# EasyEDA Pro project K1-Core-Val-R0-G2.2-from-hub-v2.epro, schematic Schematic1
Board Name: Board1; Create Date: 2026-08-28; Page Name: P1; Project Name: K1-Core-Val-R0; Schematic Name: Schematic1; Update Date: 2026-08-28; Company: SPECTRASYNQ; Page Size: Custom; Version: V1.0
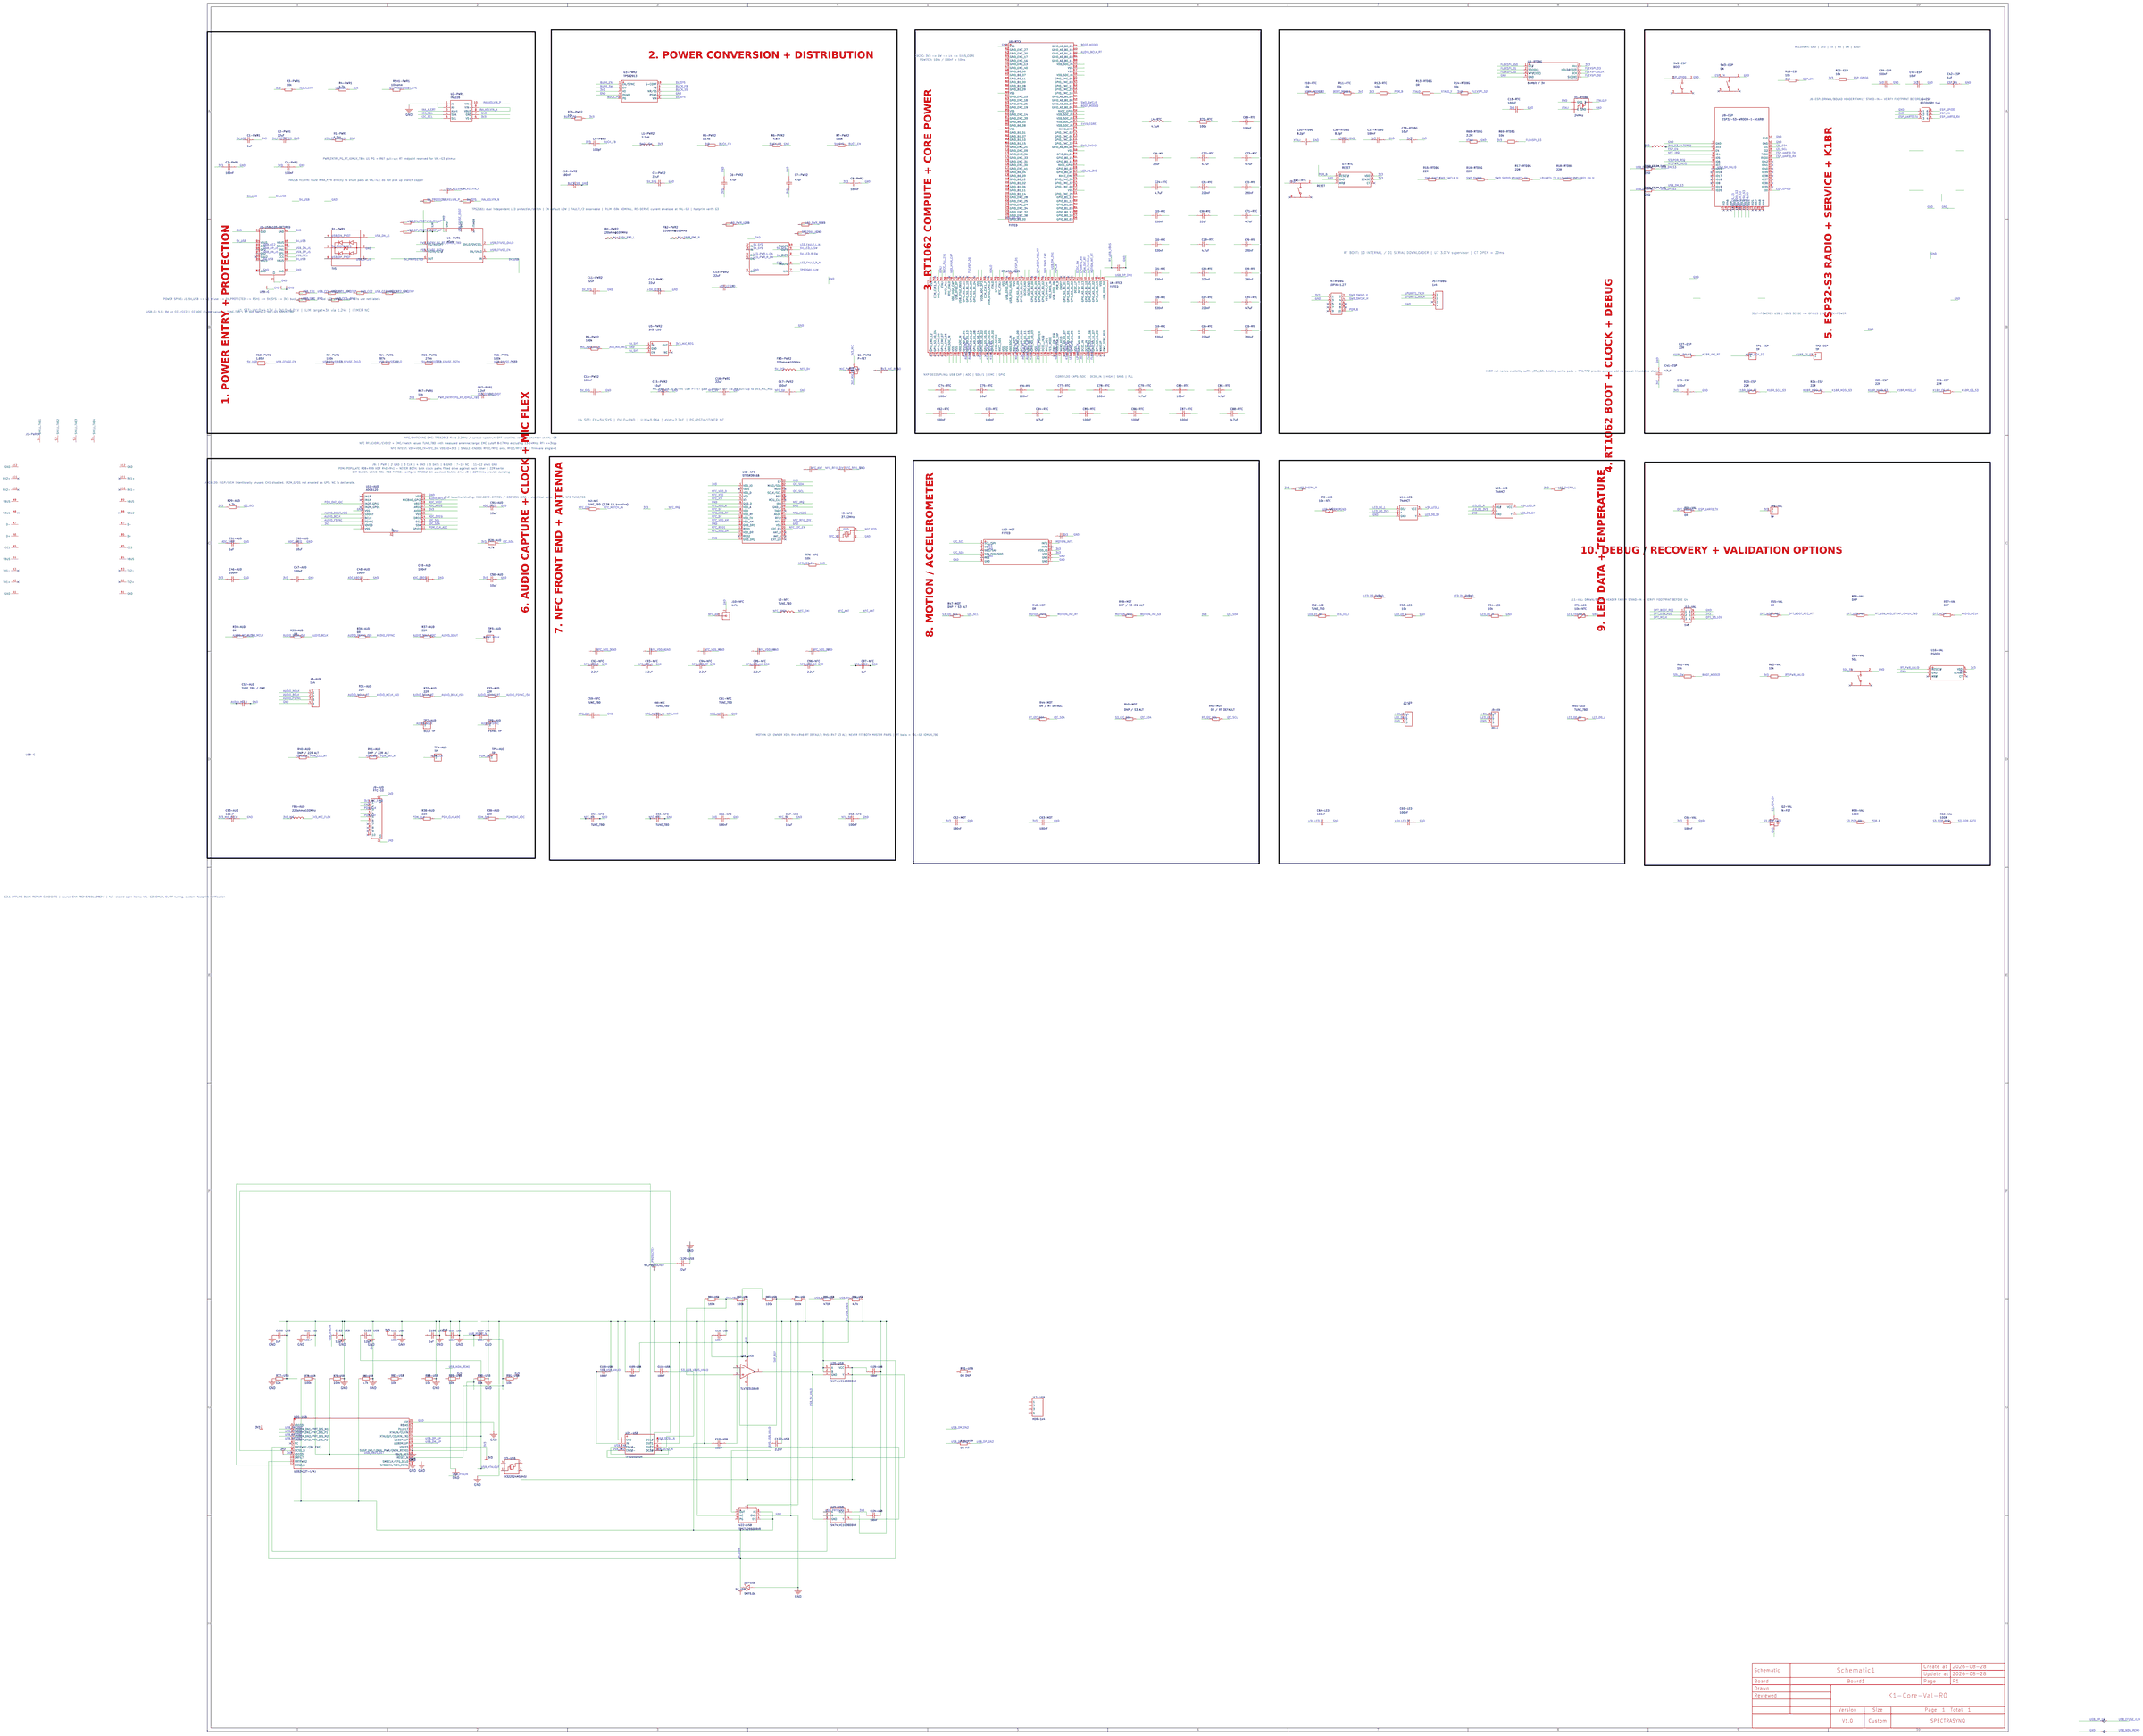
[diagram p0: schematic sheet]

## Parts
C1-PWR1  22uF  [C0805]
C2-PWR1  22uF  [C0805]
C3-PWR1  100nF  [C0402]
C4-PWR1  100nF  [C0402]
C5-PWR2  22uF  [C0805]
C6-PWR2  47uF  [C0805]
C7-PWR2  47uF  [C0805]
C8-PWR2  100nF  [C0402]
C9-PWR2  100pF  [C0402]
C10-PWR2  100nF  [C0402]
C11-PWR2  22uF  [C0805]
C12-PWR2  22uF  [C0805]
C13-PWR2  22uF  [C0805]
C14-PWR2  100nF  [C0402]
C15-PWR2  10uF  [C0402]
C16-PWR2  22uF  [C0805]
C17-PWR2  100nF  [C0402]
C18-RTC  100nF  [C0402]
C19-RTC  220nF  [C0402]
C20-RTC  220nF  [C0402]
C21-RTC  220nF  [C0402]
C22-RTC  220nF  [C0402]
C23-RTC  220nF  [C0402]
C24-RTC  4.7uF  [C0402]
C25-RTC  22uF  [C0603]
C26-RTC  220nF  [C0402]
C27-RTC  220nF  [C0402]
C28-RTC  220nF  [C0402]
C29-RTC  4.7uF  [C0402]
C30-RTC  22uF  [C0603]
C31-RTC  220nF  [C0402]
C32-RTC  4.7uF  [C0402]
C33-RTC  220nF  [C0402]
C34-RTC  4.7uF  [C0402]
C35-RTDBG  8.2pF  [C0402]
C36-RTDBG  8.2pF  [C0402]
C37-RTDBG  100nF  [C0402]
C38-RTDBG  10uF  [C0402]
C39-ESP  100nF  [C0402]
C40-ESP  10uF  [C0402]
C41-ESP  47uF  [C0805]
C42-ESP  1uF  [C0402]
C45-ESP  100nF  [C0402]
C46-AUD  100nF  [C0402]
C47-AUD  100nF  [C0402]
C48-AUD  100nF  [C0402]
C49-AUD  100nF  [C0402]
C50-AUD  10uF  [C0402]
C51-AUD  1uF  [C0402]
C52-AUD  TUNE_TBD  [C0402]  (no BOM)
C53-AUD  100nF  [C0402]
C54-NFC  TUNE_TBD  [C0402]  (no BOM)
C55-NFC  TUNE_TBD  [C0402]  (no BOM)
C56-NFC  100nF  [C0402]
C57-NFC  10uF  [C0402]
C58-NFC  100nF  [C0402]
C59-NFC  TUNE_TBD  [C0402]
C60-NFC  TUNE_TBD  [C0402]
C61-NFC  TUNE_TBD  [C0402]
C62-MOT  100nF  [C0402]
C63-MOT  100nF  [C0402]
C64-LED  100nF  [C0402]
C65-LED  100nF  [C0402]
C66-VAL  100nF  [C0402]
C67-PWR1  2.2nF  [C0402]
C69-RTC  220nF  [C0402]
C70-RTC  220nF  [C0402]
C71-RTC  4.7uF  [C0402]
C72-RTC  220nF  [C0402]
C73-RTC  4.7uF  [C0402]
C74-RTC  100nF  [C0402]
C75-RTC  10uF  [C0402]
C76-RTC  220nF  [C0402]
C77-RTC  1uF  [C0402]
C78-RTC  100nF  [C0402]
C79-RTC  4.7uF  [C0402]
C80-RTC  100nF  [C0402]
C81-RTC  4.7uF  [C0402]
C82-RTC  100nF  [C0402]
C83-RTC  100nF  [C0402]
C84-RTC  4.7uF  [C0402]
C85-RTC  100nF  [C0402]
C86-RTC  100nF  [C0402]
C87-RTC  100nF  [C0402]
C88-RTC  4.7uF  [C0402]
C89-RTC  100nF  [C0402]
C90-AUD  10uF  [C0402]
C91-AUD  10uF  [C0402]
C92-NFC  2.2uF  [C0402]
C93-NFC  2.2uF  [C0402]
C94-NFC  2.2uF  [C0402]
C95-NFC  2.2uF  [C0402]
C96-NFC  2.2uF  [C0402]
C97-NFC  1uF  [C0402]
C98-NFC  10nF  [C0402]  (no BOM)
C99-NFC  10nF  [C0402]  (no BOM)
C100-USB  1uF  [C0603]
C101-USB  100nF  [C0603]
C102-USB  12pF  [C0402]
C103-USB  12pF  [C0402]
C104-USB  100nF  [C0603]
C105-USB  1uF  [C0603]
C106-USB  100nF  [C0603]
C107-USB  100nF  [C0603]
C108-USB  100nF  [C0603]
C109-USB  100nF  [C0603]
C110-USB  100nF  [C0603]
C120-USB  22uF  [C0805]
C121-USB  100nF  [C0603]
C122-USB  2.2uF  [C0603]
C123-USB  100nF  [C0603]
C124-USB  100nF  [C0603]
C125-USB  100nF  [C0603]
C910-NFC  10nF  [C0402]  (no BOM)
C911-NFC  10nF  [C0402]  (no BOM)
C912-NFC  10nF  [C0402]  (no BOM)
CINA_DIFF-PWR1  100nF  [C0402]
CMICREG-PWR2  1uF  [C0402]
CMOT-BULK  10uF  [C0402]
CUSBVBUS-RTC  1uF  [C0402]
CVDR1-NFC  TUNE_TBD  [C0402]  (no BOM)
CVDR2-NFC  TUNE_TBD  [C0402]  (no BOM)
D1-PWR1  TVS  [SOT-23-6_L2.9-W1.6-P0.95-LS2.8-BL]
D3-USB  SMF5.0A  [SOD-123FL_L2.7-W1.8-LS3.7-RD]
FB1-PWR2  220ohm@100MHz  [L0805]
FB2-PWR2  220ohm@100MHz  [L0805]
FB3-PWR2  220ohm@100MHz  [L0805]
FB5-AUD  220ohm@100MHz  [L0402]
FB6-ESP  BLM21PG221SN1D  [L0805]
J1-PWR1  USB-C  [GT-USB-7005A-IND]  (section 1)
J1-USB4105-RETIRED  USB-C  [TYPE-C-SMD_SBC-160S1A-20-S412]
J2-LED  XH-3  [CONN-TH_3P-P2.54_B3B-XH-A-3PZZ]
J3-LED  XH-3  [CONN-TH_3P-P2.54_B3B-XH-A-3PZZ]
J4-RTDBG  10PIN-1.27  [HDR-SMD_10P-P1.27-V-R2-C5-S5.8]
J5-RTDBG  1x4  [HDR-TH_4P-P2.54-V-M_2]
J6-ESP  RECOVERY 1x6  [CONN-TH_6P-P2.50-V-M_HEADER-MALE]
J8-AUD  1x4  [HDR-TH_4P-P2.54-V-M_2]
J9-AUD  FFC-10  [FPC-SMD_FH12-10S-0.5SH-55]
J10-NFC  U.FL  [IPEX-SMD_4P-L2.6-W2.6-LS3.0-1]
J11-VAL  1x6  [CONN-TH_6P-P2.50-V-M_HEADER-MALE]
J12-USB  HDR-1x4  [HDR-TH_4P-P2.54-V-M]
L1-PWR2  2.2uH  [IND-SMD_L4.0-W4.0_XAL4030-682MEC]
L2-NFC  TUNE_TBD  [IND-SMD_L1.0-W0.5-2]
L4-RTC  4.7uH  [IND-SMD_L4.0-W4.0_XAL4040-103]
Q1-PWR2  P-FET  [SOT-23-3_L2.9-W1.3-P0.95-LS2.4-BR-1]
Q2-VAL  N-FET  [SOT-23-3_L2.9-W1.3-P1.90-LS2.4-BR]
R1-PWR1  1.24kΩ  [R0402]
R2-PWR1  100kΩ  [R0402]
R3-PWR1  10kΩ  [R0402]
R4-PWR1  4.7kΩ  [R0402]
R5-PWR2  15.4kΩ  [R0402]
R6-PWR2  4.87kΩ  [R0402]
R7-PWR2  100kΩ  [R0402]
R9-PWR2  100kΩ  [R0402]
R10-RTC  10kΩ  [R0402]
R11-RTC  10kΩ  [R0402]
R12-RTC  10kΩ  [R0402]
R13-RTDBG  0Ω  [R0402]
R14-RTDBG  10kΩ  [R0402]
R15-RTDBG  22Ω  [R0402]
R16-RTDBG  22Ω  [R0402]
R17-RTDBG  22Ω  [R0402]
R18-RTDBG  22Ω  [R0402]
R19-ESP  10kΩ  [R0402]
R20-ESP  10kΩ  [R0402]
R23-ESP  22Ω  [R0402]
R24-ESP  22Ω  [R0402]
R25-ESP  22Ω  [R0402]
R26-ESP  22Ω  [R0402]
R27-ESP  22Ω  [R0402]
R28-AUD  4.7kΩ  [R0402]
R29-AUD  4.7kΩ  [R0402]
R31-AUD  22Ω  [R0402]
R32-AUD  22Ω  [R0402]
R33-AUD  22Ω  [R0402]
R34-AUD  0Ω  [R0402]
R35-AUD  0Ω  [R0402]
R36-AUD  0Ω  [R0402]
R37-AUD  22Ω  [R0402]
R38-AUD  22Ω  [R0402]
R39-AUD  22Ω  [R0402]
R40-AUD  22Ω  [R0402]  (no BOM)
R41-AUD  22Ω  [R0402]  (no BOM)
R42-NFC  TUNE_TBD  [R0402]
R44-MOT  0Ω  [R0402]
R45-MOT  0Ω  [R0402]  (no BOM)
R46-MOT  0Ω  [R0402]
R47-MOT  0Ω  [R0402]  (no BOM)
R48-MOT  0Ω  [R0402]
R49-MOT  10kΩ  [R0402]  (no BOM)
R51-LED  TUNE_TBD  [R0402]  (no BOM)
R52-LED  TUNE_TBD  [R0402]  (no BOM)
R53-LED  10kΩ  [R0402]
R54-LED  10kΩ  [R0402]
R55-VAL  0Ω  [R0402]
R56-VAL  10kΩ  [R0402]  (no BOM)
R57-VAL  10kΩ  [R0402]  (no BOM)
R58-VAL  0Ω  [R0402]
R59-VAL  100Ω  [R0402]
R60-VAL  100Ω  [R0402]
R61-VAL  10kΩ  [R0402]
R62-VAL  10kΩ  [R0402]
R63-PWR1  1.05MΩ  [R0402]
R64-PWR1  287kΩ  [R0402]
R65-PWR1  274kΩ  [R0402]
R66-PWR1  100kΩ  [R0402]
R67-PWR1  10kΩ  [R0402]
R68-RTDBG  2.2MΩ  [R0402]
R69-RTDBG  10kΩ  [R0402]
R70-RTC  100kΩ  [R0402]
R75-PWR2  10kΩ  [R0402]
R76-NFC  10kΩ  [R0402]
R77-USB  12kΩ  [R0402]
R78-USB  100kΩ  [R0402]
R79-USB  100kΩ  [R0402]
R80-USB  4.7kΩ  [R0402]
R81-USB  169kΩ  [R0402]
R82-USB  100kΩ  [R0402]
R83-USB  100kΩ  [R0402]
R84-USB  100kΩ  [R0402]
R85-USB  470Ω  [R0402]
R86-USB  4.7kΩ  [R0402]
R87-USB  10kΩ  [R0402]
R88-USB  10kΩ  [R0402]
R89-USB  10kΩ  [R0402]
R90-USB  10kΩ  [R0402]
R91-USB  10kΩ  [R0402]
R94-USB  0Ω  [R0402]
R95-USB  0Ω  [R0402]
RCC1-PWR1  5.1kΩ  [R0402]
RCC1B-PWR1  TUNE_TBD  [R0402]  (no BOM)
RCC1S-PWR1  TUNE_TBD  [R0402]  (no BOM)
RCC2-PWR1  5.1kΩ  [R0402]
RCC2B-PWR1  TUNE_TBD  [R0402]  (no BOM)
RCC2S-PWR1  TUNE_TBD  [R0402]  (no BOM)
RILIM-LED  59kΩ  [R0402]  (no BOM)
RINA_N-PWR1  10Ω  [R0402]
RINA_P-PWR1  10Ω  [R0402]
RLED_ENL_PD-LED  10kΩ  [R0402]
RLED_ENR_PD-LED  10kΩ  [R0402]
RLED_PD0-LED  10kΩ  [R0402]
RLED_PD1-LED  10kΩ  [R0402]
RNTC_L-LED  10kΩ  [R0402]
RNTC_R-LED  10kΩ  [R0402]
RSH1-PWR1  10mΩ  [R2818]
RT1-LED  10k-NTC  [R0402]
RT2-LED  10k-NTC  [R0402]
RUSB_DN-PWR1  0Ω  [R0402]
RUSB_DP-PWR1  0Ω  [R0402]
RUSB_S3_DM_TUNE  22Ω  [R0402]
RUSB_S3_DP_TUNE  22Ω  [R0402]
SW1-RTC  RESET  [KEY-SMD_4P-L6.0-W6.0-P4.50-LS9.0]
SW2-ESP  BOOT  [KEY-SMD_4P-L6.0-W6.0-P4.50-LS9.0]
SW3-ESP  EN  [KEY-SMD_4P-L6.0-W6.0-P4.50-LS9.0]
SW4-VAL  SDL  [KEY-SMD_4P-L6.0-W6.0-P4.50-LS9.0]
TP1-ESP  TP  [TESTPOINT-TH_BD3.2]  (no BOM)
TP2-ESP  TP  [TESTPOINT-TH_BD3.2]  (no BOM)
TP3-AUD  TP  [TESTPOINT-TH_BD3.2]  (no BOM)
TP4-AUD  TP  [TESTPOINT-TH_BD3.2]  (no BOM)
TP5-AUD  TP  [TESTPOINT-TH_BD3.2]  (no BOM)
TP6-VAL  TP  [TESTPOINT-TH_BD3.2]  (no BOM)
TP7-AUD  BCLK TP  [TESTPOINT-TH_BD3.2]  (no BOM)
TP8-AUD  FSYNC TP  [TESTPOINT-TH_BD3.2]  (no BOM)
U1-PWR1  eFuse  [VQFN-10_L2.0-W2.0-P0.45-TL]
U2-PWR1  INA226  [MSOP-10_L3.0-W3.0-P0.50-LS5.0-BL]
U3-PWR2  TPS62913  [QFN-10_L2.0-W2.0-P0.50_TPS62912RPUR]
U5-PWR2  3V3-LDO  [SOT-23-5_L3.0-W1.7-P0.95-LS2.8-BR]
U6-RTC  FITTED  [LFBGA-196_L12.0-W12.0-R14-C14-P0.80-BL]  (sections 1,2)
U7-RTC  RESET  [SOT-23-6_L2.9-W1.6-P0.95-LS2.8-BR]
U8-RTDBG  64Mbit / 3V  [SOIC-8_L5.3-W5.3-P1.27-LS8.0-BL]
U9-ESP  2.4GHz  [WIRELM-SMD_ESP32-S3-WROOM-1]
U11-AUD  ADC6120  [WQFN-20_L3.0-W3.0-P0.50-TL-EP1.4]
U12-NFC  13.56MHz  [VFQFPN-32_L5.0-W5.0-P0.50-TL-EP3.5]
U13-MOT  FITTED  [LGA-12_L2.0-W2.0-P0.50-BL]
U14-LED  74AHCT  [SOT-23-5_L3.0-W1.7-P0.95-LS2.8-BR]
U15-LED  74AHCT  [SOT-23-5_L3.0-W1.7-P0.95-LS2.8-BR]
U16-VAL  PGOOD  [SOT-23-6_L2.9-W1.6-P0.95-LS2.8-BR]
U17-PWR2  TPS2561 dual LED branch switch
U20-USB  USB2422T-I/MJ  [QFN-24_L4.0-W4.0-P0.50-TL-EP2.5]
U21-USB  TPS2052BDR  [SOIC-8_L4.9-W3.9-P1.27-LS6.0-BL]
U22-USB  TPS7A2550DRVR  [WSON-6_L2.0-W2.0-P0.65-TL-EP]
U23-USB  TLV7031DBVR  [SOT-23-5_L2.9-W1.6-P0.95-LS2.8-BR]
U24-USB  SN74LVC1G08DBVR  [SOT-23-5_L3.0-W1.7-P0.95-LS2.8-BR]
U25-USB  SN74LVC1G08DBVR  [SOT-23-5_L3.0-W1.7-P0.95-LS2.8-BR]
Y1-RTDBG  24MHz  [CRYSTAL-SMD_4P-L2.0-W1.6-BL-B]
Y2-NFC  27.12MHz  [CRYSTAL-SMD_4P-L1.6-W1.2-BL]
Y3-USB  24MHz  [CRYSTAL-SMD_4P-L3.2-W2.5-BL]

## Library data of the parts
C1-PWR1 = GRM21BR61E226ME44L: Capacitance:22uF Tolerance:±20% Tolerance:±20% Voltage Rating:25V Temperature Coefficient:X5R; LCSC Part Name: 22uF ±20% 25V; Supplier Part: GRM21BR61E226ME44L.1; Manufacturer: muRata(村田); Supplier Footprint: 0805; JLCPCB Part Class: Extended Part; Datasheet: https://item.szlcsc.com/datasheet/GRM21BR61E226ME44L/87993.html; Supplier: LCSC; Tolerance: ±20%; Voltage Rating: 25V; Temperature Coefficient: X5R; supplier: LCSC; supplierId: C86816
C2-PWR1 C5-PWR2 C11-PWR2 C12-PWR2 C13-PWR2 C16-PWR2 = GRM21BR61E226ME44L: Capacitance:22uF Tolerance:±20% Tolerance:±20% Voltage Rating:25V Temperature Coefficient:X5R; LCSC Part Name: 22uF ±20% 25V; Supplier Part: C86816; Manufacturer: muRata(村田); Supplier Footprint: 0805; JLCPCB Part Class: Extended Part; Datasheet: https://item.szlcsc.com/datasheet/GRM21BR61E226ME44L/87993.html; Supplier: LCSC; Tolerance: ±20%; Voltage Rating: 25V; Temperature Coefficient: X5R; supplier: LCSC; supplierId: C86816
C3-PWR1 C4-PWR1 C8-PWR2 C10-PWR2 C14-PWR2 C17-PWR2 C18-RTC C37-RTDBG C39-ESP C45-ESP C46-AUD C47-AUD C48-AUD C49-AUD C53-AUD C56-NFC C58-NFC C62-MOT C63-MOT C64-LED C65-LED C66-VAL CINA_DIFF-PWR1 = GRM155R71C104KA88D: Capacitance:100nF Tolerance:±10% Tolerance:±10% Voltage Rating:16V Temperature Coefficient:X7R; LCSC Part Name: 100nF ±10% 16V; Supplier Part: C71629; Manufacturer: muRata(村田); Supplier Footprint: 0402; JLCPCB Part Class: Extended Part; Datasheet: https://item.szlcsc.com/datasheet/GRM155R71C104KA88D/72737.html; Supplier: LCSC; Tolerance: ±10%; Voltage Rating: 16V; Temperature Coefficient: X7R; supplier: LCSC; supplierId: C71629
C6-PWR2 C7-PWR2 C41-ESP = GRM21BR61A476ME15L: Capacitance:47uF Tolerance:±20% Tolerance:±20% Voltage Rating:10V Temperature Coefficient:X5R; LCSC Part Name: 47uF ±20% 10V; Supplier Part: C124129; Manufacturer: muRata(村田); Supplier Footprint: 0805; JLCPCB Part Class: Extended Part; Datasheet: https://item.szlcsc.com/datasheet/GRM21BR61A476ME15L/125403.html; Supplier: LCSC; Tolerance: ±20%; Voltage Rating: 10V; Temperature Coefficient: X5R; supplier: LCSC; supplierId: C124129
C9-PWR2 = GRM1555C1H101JA01D: Capacitance:100pF Tolerance:±5% Tolerance:±5% Voltage Rating:50V Temperature Coefficient:C0G; LCSC Part Name: 100pF ±5% 50V; Supplier Part: C77177; Manufacturer: muRata(村田); Supplier Footprint: 0402; JLCPCB Part Class: Extended Part; Datasheet: https://item.szlcsc.com/datasheet/GRM1555C1H101JA01D/78305.html; Supplier: LCSC; Tolerance: ±5%; Voltage Rating: 50V; Temperature Coefficient: C0G; supplier: LCSC; supplierId: C77177
C15-PWR2 C38-RTDBG C40-ESP C50-AUD C57-NFC C90-AUD C91-AUD CMOT-BULK = GRM155R60J106ME44D: Capacitance:10uF Tolerance:±20% Tolerance:±20% Voltage Rating:6.3V Temperature Coefficient:X5R; LCSC Part Name: 10uF ±20% 6.3V; Supplier Part: C76991; Manufacturer: muRata(村田); Supplier Footprint: 0402; JLCPCB Part Class: Extended Part; Datasheet: https://item.szlcsc.com/datasheet/GRM155R60J106ME44D/78118.html; Supplier: LCSC; Tolerance: ±20%; Voltage Rating: 6.3V; Temperature Coefficient: X5R; supplier: LCSC; supplierId: C76991
C19-RTC C20-RTC C21-RTC C22-RTC C23-RTC C26-RTC C27-RTC C28-RTC C31-RTC C33-RTC C69-RTC C70-RTC C72-RTC C76-RTC = GRM155R61A224KE19D: Capacitance:220nF Tolerance:±10% Tolerance:±10% Voltage Rating:10V Temperature Coefficient:X5R; LCSC Part Name: 220nF ±10% 10V; Supplier Part: C77001; Manufacturer: Murata; Supplier Footprint: 0402; JLCPCB Part Class: Extended Part; Datasheet: https://item.szlcsc.com/datasheet/GRM155R61A224KE19D/78128.html; Supplier: LCSC; Tolerance: ±10%; Voltage Rating: 10V; Temperature Coefficient: X5R; supplier: LCSC; supplierId: C77001
C24-RTC C29-RTC C32-RTC C34-RTC C71-RTC C73-RTC C79-RTC C81-RTC C84-RTC C88-RTC = GRM155R60J475ME47D: Capacitance:4.7uF Tolerance:±20% Tolerance:±20% Voltage Rating:6.3V Temperature Coefficient:X5R; LCSC Part Name: 4.7uF ±20% 6.3V; Supplier Part: C82453; Manufacturer: Murata; Supplier Footprint: 0402; JLCPCB Part Class: Extended Part; Datasheet: https://item.szlcsc.com/datasheet/GRM155R60J475ME47D/83610.html; Supplier: LCSC; Tolerance: ±20%; Voltage Rating: 6.3V; Temperature Coefficient: X5R; supplier: LCSC; supplierId: C82453
C25-RTC C30-RTC = GRM188R60J226MEA0D: Capacitance:22uF Tolerance:±20% Tolerance:±20% Voltage Rating:6.3V Temperature Coefficient:X5R; LCSC Part Name: 22uF ±20% 6.3V; Supplier Part: C77042; Manufacturer: Murata; Supplier Footprint: 0603; JLCPCB Part Class: Extended Part; Datasheet: https://item.szlcsc.com/datasheet/GRM188R60J226MEA0D/78169.html; Supplier: LCSC; Tolerance: ±20%; Voltage Rating: 6.3V; Temperature Coefficient: X5R; supplier: LCSC; supplierId: C77042
C35-RTDBG C36-RTDBG = GRM1555C1H8R2CA01D: Capacitance:8.2pF Voltage Rating:50V Temperature Coefficient:C0G; LCSC Part Name: ±0.25pF 8.2pF 50V; Supplier Part: C76984; Manufacturer: muRata(村田); Supplier Footprint: 0402; JLCPCB Part Class: Extended Part; Datasheet: https://item.szlcsc.com/datasheet/GRM1555C1H8R2CA01D/78111.html; Supplier: LCSC; Voltage Rating: 50V; Temperature Coefficient: C0G; supplier: LCSC; supplierId: C76984
C42-ESP C51-AUD C97-NFC CMICREG-PWR2 CUSBVBUS-RTC = GRM155R61A105KE15D: Capacitance:1uF Tolerance:±10% Tolerance:±10% Voltage Rating:10V Temperature Coefficient:X5R; LCSC Part Name: 1uF ±10% 10V; Supplier Part: C76999; Manufacturer: muRata(村田); Supplier Footprint: 0402; JLCPCB Part Class: Extended Part; Datasheet: https://item.szlcsc.com/datasheet/GRM155R61A105KE15D/78126.html; Supplier: LCSC; Tolerance: ±10%; Voltage Rating: 10V; Temperature Coefficient: X5R; supplier: LCSC; supplierId: C76999
C52-AUD = K1_CAP0402_TUNE_TBD: Capacitance:100nF Tolerance:±10% Tolerance:±10% Voltage Rating:16V Temperature Coefficient:X7R; LCSC Part Name: 100nF ±10% 16V; Supplier Part: GRM1555C1H101JA01D.1; Supplier Footprint: 0402; JLCPCB Part Class: Extended Part; Datasheet: https://item.szlcsc.com/datasheet/GRM155R71C104KA88D/72737.html; Tolerance: ±10%; Voltage Rating: 16V; Temperature Coefficient: X7R; supplier: LCSC; supplierId: GRM1555C1H101JA01D.1
C54-NFC C55-NFC = K1_XTAL_LOAD_CAP_TUNE_TBD: Capacitance:100nF Tolerance:±10% Tolerance:±10% Voltage Rating:16V Temperature Coefficient:X7R; LCSC Part Name: 100nF ±10% 16V; Supplier Part: GRM1555C1H100JA01D.1; Supplier Footprint: 0402; JLCPCB Part Class: Extended Part; Datasheet: https://item.szlcsc.com/datasheet/GRM155R71C104KA88D/72737.html; Tolerance: ±10%; Voltage Rating: 16V; Temperature Coefficient: X7R; supplier: LCSC; supplierId: GRM1555C1H100JA01D.1
C59-NFC = GRM1555C1H220JA01D: Capacitance:22pF Tolerance:±5% Tolerance:±5% Voltage Rating:50V Temperature Coefficient:C0G; LCSC Part Name: 22pF ±5% 50V; Supplier Part: C76960; Manufacturer: muRata(村田); Supplier Footprint: 0402; JLCPCB Part Class: Extended Part; Datasheet: https://item.szlcsc.com/datasheet/GRM1555C1H220JA01D/78087.html; Supplier: LCSC; Tolerance: ±5%; Voltage Rating: 50V; Temperature Coefficient: C0G; supplier: LCSC; supplierId: C76960
C60-NFC = GRM1555C1H330JA01D: Capacitance:33pF Tolerance:±5% Tolerance:±5% Voltage Rating:50V Temperature Coefficient:C0G; LCSC Part Name: 33pF ±5% 50V; Supplier Part: C76964; Manufacturer: muRata(村田); Supplier Footprint: 0402; JLCPCB Part Class: Extended Part; Datasheet: https://item.szlcsc.com/datasheet/GRM1555C1H330JA01D/78091.html; Supplier: LCSC; Tolerance: ±5%; Voltage Rating: 50V; Temperature Coefficient: C0G; supplier: LCSC; supplierId: C76964
C61-NFC = GRM1555C1H470JA01D: Capacitance:47pF Tolerance:±5% Tolerance:±5% Voltage Rating:50V Temperature Coefficient:C0G; LCSC Part Name: 47pF ±5% 50V; Supplier Part: C76970; Manufacturer: muRata(村田); Supplier Footprint: 0402; JLCPCB Part Class: Extended Part; Datasheet: https://item.szlcsc.com/datasheet/GRM1555C1H470JA01D/78097.html; Supplier: LCSC; Tolerance: ±5%; Voltage Rating: 50V; Temperature Coefficient: C0G; supplier: LCSC; supplierId: C76970
C67-PWR1 = GRM155R71H222KA01D: Capacitance:2.2nF Tolerance:±10% Tolerance:±10% Voltage Rating:50V Temperature Coefficient:X7R; LCSC Part Name: 2.2nF ±10% 50V; Supplier Part: C77022; Manufacturer: muRata(村田); Supplier Footprint: 0402; JLCPCB Part Class: Extended Part; Datasheet: https://item.szlcsc.com/datasheet/GRM155R71H222KA01D/78149.html; Supplier: LCSC; Tolerance: ±10%; Voltage Rating: 50V; Temperature Coefficient: X7R; supplier: LCSC; supplierId: C77022
C74-RTC C78-RTC C80-RTC C82-RTC C83-RTC C85-RTC C86-RTC C87-RTC C89-RTC = GRM155R71C104KA88D: Capacitance:100nF Tolerance:±10% Tolerance:±10% Voltage Rating:16V Temperature Coefficient:X7R; LCSC Part Name: 100nF ±10% 16V; Supplier Part: C71629; Manufacturer: Murata; Supplier Footprint: 0402; JLCPCB Part Class: Extended Part; Datasheet: https://item.szlcsc.com/datasheet/GRM155R71C104KA88D/72737.html; Supplier: LCSC; Tolerance: ±10%; Voltage Rating: 16V; Temperature Coefficient: X7R; supplier: LCSC; supplierId: C71629
C75-RTC = GRM155R60J106ME44D: Capacitance:10uF Tolerance:±20% Tolerance:±20% Voltage Rating:6.3V Temperature Coefficient:X5R; LCSC Part Name: 10uF ±20% 6.3V; Supplier Part: C76991; Manufacturer: Murata; Supplier Footprint: 0402; JLCPCB Part Class: Extended Part; Datasheet: https://item.szlcsc.com/datasheet/GRM155R60J106ME44D/78118.html; Supplier: LCSC; Tolerance: ±20%; Voltage Rating: 6.3V; Temperature Coefficient: X5R; supplier: LCSC; supplierId: C76991
C77-RTC = GRM155R61A105KE15D: Capacitance:1uF Tolerance:±10% Tolerance:±10% Voltage Rating:10V Temperature Coefficient:X5R; LCSC Part Name: 1uF ±10% 10V; Supplier Part: C76999; Manufacturer: Murata; Supplier Footprint: 0402; JLCPCB Part Class: Extended Part; Datasheet: https://item.szlcsc.com/datasheet/GRM155R61A105KE15D/78126.html; Supplier: LCSC; Tolerance: ±10%; Voltage Rating: 10V; Temperature Coefficient: X5R; supplier: LCSC; supplierId: C76999
C92-NFC C93-NFC C94-NFC C95-NFC C96-NFC = GRM155R60J225ME15D: Capacitance:2.2uF Tolerance:±20% Tolerance:±20% Voltage Rating:6.3V Temperature Coefficient:X5R; LCSC Part Name: 2.2uF ±20% 6.3V; Supplier Part: C76993; Manufacturer: muRata(村田); Supplier Footprint: 0402; JLCPCB Part Class: Extended Part; Datasheet: https://item.szlcsc.com/datasheet/GRM155R60J225ME15D/78120.html; Supplier: LCSC; Tolerance: ±20%; Voltage Rating: 6.3V; Temperature Coefficient: X5R; supplier: LCSC; supplierId: C76993
C98-NFC C99-NFC C910-NFC C911-NFC C912-NFC = K1_CAP0402_10nF_TBD_SUPPLIER: Capacitance:100nF Tolerance:±10% Tolerance:±10% Voltage Rating:16V Temperature Coefficient:X7R; LCSC Part Name: 100nF ±10% 16V; Supplier Footprint: 0402; JLCPCB Part Class: Extended Part; Datasheet: https://item.szlcsc.com/datasheet/GRM155R71C104KA88D/72737.html; Tolerance: ±10%; Voltage Rating: 16V; Temperature Coefficient: X7R
C100-USB C105-USB = CL10A105KB8NNNC: Capacitance:1uF Tolerance:±10% Tolerance:±10% Voltage Rating:50V Temperature Coefficient:X5R; LCSC Part Name: 1uF ±10% 50V; Supplier Part: CL10A105KB8NNNC.1; Manufacturer: SAMSUNG(三星); Supplier Footprint: 0603; JLCPCB Part Class: Basic Part; Datasheet: https://item.szlcsc.com/datasheet/CL10A105KB8NNNC/16531.html; Supplier: LCSC; Tolerance: ±10%; Voltage Rating: 50V; Temperature Coefficient: X5R
C101-USB C104-USB C106-USB C107-USB C108-USB C109-USB C110-USB = CC0603KRX7R9BB104: Capacitance:100nF Tolerance:±10% Tolerance:±10% Voltage Rating:50V Temperature Coefficient:X7R; LCSC Part Name: 100nF ±10% 50V; Supplier Part: CC0603KRX7R9BB104.1; Manufacturer: YAGEO(国巨); Supplier Footprint: 0603; JLCPCB Part Class: Basic Part; Datasheet: https://item.szlcsc.com/datasheet/CC0603KRX7R9BB104/15331.html; Supplier: LCSC; Tolerance: ±10%; Voltage Rating: 50V; Temperature Coefficient: X7R
C102-USB C103-USB = 0402CG120J500NT: Capacitance:12pF Tolerance:±5% Tolerance:±5% Voltage Rating:50V Temperature Coefficient:C0G; LCSC Part Name: 12pF ±5% 50V; Supplier Part: 0402CG120J500NT.1; Manufacturer: FH(风华); Supplier Footprint: 0402; JLCPCB Part Class: Basic Part; Datasheet: https://item.szlcsc.com/datasheet/0402CG120J500NT/1899.html; Supplier: LCSC; Tolerance: ±5%; Voltage Rating: 50V; Temperature Coefficient: C0G
C120-USB = CL21A226MAQNNNE: Capacitance:22uF Tolerance:±20% Tolerance:±20% Voltage Rating:25V Temperature Coefficient:X5R; LCSC Part Name: 22uF ±20% 25V; Supplier Part: C45783; Manufacturer: SAMSUNG(三星); Supplier Footprint: 0805; JLCPCB Part Class: Basic Part; Datasheet: https://item.szlcsc.com/datasheet/CL21A226MAQNNNE/46786.html; Supplier: LCSC; Tolerance: ±20%; Voltage Rating: 25V; Temperature Coefficient: X5R
C121-USB C123-USB C124-USB C125-USB = CC0603KRX7R9BB104: Capacitance:100nF Tolerance:±10% Tolerance:±10% Voltage Rating:50V Temperature Coefficient:X7R; LCSC Part Name: 100nF ±10% 50V; Supplier Part: C14663; Manufacturer: YAGEO(国巨); Supplier Footprint: 0603; JLCPCB Part Class: Basic Part; Datasheet: https://item.szlcsc.com/datasheet/CC0603KRX7R9BB104/15331.html; Supplier: LCSC; Tolerance: ±10%; Voltage Rating: 50V; Temperature Coefficient: X7R
C122-USB = CL10A225KO8NNNC: Capacitance:2.2uF Tolerance:±10% Tolerance:±10% Voltage Rating:16V Temperature Coefficient:X5R; LCSC Part Name: 2.2uF ±10% 16V; Supplier Part: C23630; Manufacturer: SAMSUNG(三星); Supplier Footprint: 0603; JLCPCB Part Class: Basic Part; Datasheet: https://item.szlcsc.com/datasheet/CL10A225KO8NNNC/24366.html; Supplier: LCSC; Tolerance: ±10%; Voltage Rating: 16V; Temperature Coefficient: X5R
CVDR1-NFC CVDR2-NFC = K1_CAP0402_TUNE_TBD: Capacitance:100nF Tolerance:±10% Tolerance:±10% Voltage Rating:16V Temperature Coefficient:X7R; LCSC Part Name: 100nF ±10% 16V; Supplier Footprint: 0402; JLCPCB Part Class: Extended Part; Datasheet: https://item.szlcsc.com/datasheet/GRM155R71C104KA88D/72737.html; Tolerance: ±10%; Voltage Rating: 16V; Temperature Coefficient: X7R
D1-PWR1 = USBLC6-2SC6: Reverse Stand-Off Voltage (Vrwm):5V Maximum Clamping Voltage:20V Peak Pulse Current (Ipp)@10/1000us:5A Breakdown Voltage:6V Type:ESD; LCSC Part Name: ESD二极管 USBLC6-2SC6; Supplier Part: C323793; Supplier Footprint: SOT-23-6; JLCPCB Part Class: Extended Part; Datasheet: https://atta.szlcsc.com/upload/public/pdf/source/20181029/C323793_48F7908330A3F84485333C8DC43F9E49.pdf; Supplier: LCSC; Reverse Stand-Off Voltage (Vrwm): 5V; Maximum Clamping Voltage: 20V; Peak Pulse Current (Ipp)@10/1000us: 5A; Breakdown Voltage: 6V; Type: ESD; supplier: LCSC; supplierId: C323793
D3-USB = SMF5.0A_C2758488: Polarity:Unidirectional Reverse Stand-Off Voltage (Vrwm):5V Clamping Voltage:9.2V Peak Pulse Current (Ipp):21.7A Peak Pulse Power Dissipation (Ppp):200W@10/1000us Voltage - Breakdown:6.4V Reverse Leakage Current (Ir):400uA level of protection:IEC 61000-4-; LCSC Part Name: 单向TVS 5V截止 峰值浪涌电流：21.7A; Supplier Part: C2758488; Manufacturer: UMW(友台半导体); Supplier Footprint: SOD-123FL; JLCPCB Part Class: Extended Part; Datasheet: https://item.szlcsc.com/datasheet/SMF5.0A/2877390.html; Supplier: LCSC; Polarity: Unidirectional; Reverse Stand-Off Voltage (Vrwm): 5V; Clamping Voltage: 9.2V; Peak Pulse Current (Ipp): 21.7A; Peak Pulse Power Dissipation (Ppp): 200W@10/1000us; Voltage - Breakdown: 6.4V; Reverse Leakage Current (Ir): 400uA; level of protection: IEC 61000-4-4；IEC 61000-4-2; Type: TVS
FB1-PWR2 FB2-PWR2 FB3-PWR2 FB6-ESP = BLM21PG221SN1D: Impedance @ Frequency:220Ω@100MHz Tolerance:±25% Tolerance:±25% DC Resistance(DCR):45mΩ Current Rating:2A Number of Circuits:1 Operating Temperature:-55℃~+125℃ Operating Temperature:-55℃~+125℃; LCSC Part Name: 单路 0805磁珠 阻抗220Ω@100MHz; Supplier Part: C85840; Manufacturer: muRata(村田); Supplier Footprint: 0805; JLCPCB Part Class: Extended Part; Datasheet: https://item.szlcsc.com/datasheet/BLM21PG221SN1D/87016.html; Supplier: LCSC; Impedance @ Frequency: 220Ω@100MHz; Tolerance: ±25%; DC Resistance(DCR): 45mΩ; Current Rating: 2A; Number of Circuits: 1; Operating Temperature: -55℃~+125℃; supplier: LCSC; supplierId: C85840
FB5-AUD = BLM15AG221SN1D: Impedance @ Frequency:220Ω@100MHz Tolerance:±25% Tolerance:±25% DC Resistance(DCR):290mΩ Current Rating:450mA Number of Circuits:1 Operating Temperature:-55℃~+125℃ Operating Temperature:-55℃~+125℃; LCSC Part Name: 单路 0402磁珠 阻抗220Ω@100MHz; Supplier Part: C85813; Manufacturer: muRata(村田); Supplier Footprint: 0402; JLCPCB Part Class: Extended Part; Datasheet: https://item.szlcsc.com/datasheet/BLM15AG221SN1D/86989.html; Supplier: LCSC; Impedance @ Frequency: 220Ω@100MHz; Tolerance: ±25%; DC Resistance(DCR): 290mΩ; Current Rating: 450mA; Number of Circuits: 1; Operating Temperature: -55℃~+125℃; supplier: LCSC; supplierId: C85813
J1-PWR1 = GT-USB-7005A-IND: Independent GT-USB-7005A from manufacturer drawing. Not LCSC C5250872 cache artwork.; Manufacturer: G-Switch; Manufacturer Part: GT-USB-7005A; Supplier: LCSC; Supplier Part: C5250872
J1-USB4105-RETIRED = USB4105-GF-A: Connector Type:Type-C Protocol Standard:USB 2.0 Gender:Female Mounting Type:Surface Mount, Right Angle Number of Contacts:12P Number of Ports:1 Current Rating-Power:5A Voltage Rating:48V Detection color:Black Operating Temperature:-40℃~+85℃ Operating Temp; LCSC Part Name: Type-C 母 卧贴; Supplier Part: USB4105-GF-A.1; Manufacturer: GCT; Supplier Footprint: SMD; JLCPCB Part Class: Extended Part; Datasheet: https://item.szlcsc.com/datasheet/USB4105-GF-A/3542626.html; Supplier: LCSC; Connector Type: Type-C; Protocol Standard: USB 2.0; Gender: Female; Mounting Type: Surface Mount, Right Angle; Number of Contacts: 12P; Number of Ports: 1; Current Rating-Power: 5A; Voltage Rating: 48V; Detection color: Black; Operating Temperature: -40℃~+85℃; supplier: LCSC; supplierId: C3020560
J2-LED J3-LED = B3B-XH-A-3PZZ: Pins Structure:1x3P Pitch:2.54mm Mounting Type:Through Hole Reference Series:XH Number of Pins:3P Number of Rows:1 Number of PINs Per Row:3 Row Spacing:- Current Rating:2A Contact Material:Brass Contact Plating:Tin Operating Temperature:-25℃~+85℃ Operatin; LCSC Part Name: 1x3P 间距:2.54mm 直插 系列:XH; Supplier Part: C54444768; Manufacturer: BXCONN(宝讯); Supplier Footprint: 插件,P=2.54mm; JLCPCB Part Class: Extended Part; Datasheet: https://item.szlcsc.com/datasheet/B3B-XH-A-3PZZ/57781635.html; Supplier: LCSC; Pins Structure: 1x3P; Pitch: 2.54mm; Mounting Type: Through Hole; Reference Series: XH; Number of Pins: 3P; Number of Rows: 1; Number of PINs Per Row: 3; Current Rating: 2A; Contact Material: Brass; Contact Plating: Tin; Operating Temperature: -25℃~+85℃; Voltage Rating: 250V; Plastic Material: PA66; Flame Retardant Rating: UL94V-0; Color: White; Z-Height of the Board: 7mm; X-Length of Bottom Edge on Board (Spacing Line): 10mm; Y-Width of Bottom Edge on Board: 5.9mm; supplier: LCSC; supplierId: C54444768
J4-RTDBG = FTSH-105-01-L-DV-K: Pin Structure:2x5P Pitch:1.27mm Circluar Pins/Square Pins:Pin Header Mounting Type:Surface Mount,Vertical Number of Rows:2 Number of Pins:10P Current Rating:3.4A Length of Mating Pin:3.05mm Length of End Connection Pin:- Contact Material:Phosphor bronze C; LCSC Part Name: 2x5P 间距:1.27mm 方针 立贴; Supplier Part: C5155080; Manufacturer: SAMTEC; Supplier Footprint: SMD,P=1.27mm; JLCPCB Part Class: Extended Part; Datasheet: https://item.szlcsc.com/datasheet/FTSH-105-01-L-DV-K/5783631.html; Supplier: LCSC; Pin Structure: 2x5P; Pitch: 1.27mm; Circluar Pins/Square Pins: Pin Header; Mounting Type: Surface Mount,Vertical; Number of Rows: 2; Number of Pins: 10P; Current Rating: 3.4A; Length of Mating Pin: 3.05mm; Contact Material: Phosphor bronze; Contact Plating: Gold; Operating Temperature: -55℃~+125℃; Color: Black; supplier: LCSC; supplierId: C5155080
J5-RTDBG J8-AUD = PREC004SAAN-RC: Pin Structure:1x4P Pitch:2.54mm Row Spacing:- Circluar Pins/Square Pins:Pin Header Mounting Type:Through Hole Number of Rows:1 Number of Pins:4P Current Rating:3A Voltage Rating (Max):- Length of Mating Pin:5.84mm Insulation Height:2.5mm Length of End Con; LCSC Part Name: 1x4P 间距:2.54mm 方针 直插; Supplier Part: C3327812; Manufacturer: Sullins; Supplier Footprint: 插件,P=2.54mm; JLCPCB Part Class: Extended Part; Datasheet: https://item.szlcsc.com/datasheet/PREC004SAAN-RC/3892409.html; Supplier: LCSC; Pin Structure: 1x4P; Pitch: 2.54mm; Circluar Pins/Square Pins: Pin Header; Mounting Type: Through Hole; Number of Rows: 1; Number of Pins: 4P; Current Rating: 3A; Length of Mating Pin: 5.84mm; Insulation Height: 2.5mm; Length of End Connection Pin: 3.05mm; Contact Material: Brass; Contact Plating: Tin; Operating Temperature: -40℃~+105℃; Color: Black; supplier: LCSC; supplierId: C3327812
J6-ESP J11-VAL = HEADER_MALE-XH_1X6P_2.54MM: Supplier Part: C9900007627; Manufacturer Part: PREC006SAAN-RC; JLCPCB Part Class: Extended Part; Supplier: LCSC; supplier: LCSC; supplierId: C9900007627
J9-AUD = FH12-10S-0.5SH(55): Locking Feature:Hinged Lid Contact Type:Bottom Contact Number of Contacts:10P Pitch:0.5mm Mounting Type:Surface Mount, Right Angle FFC, FCB Thickness:0.3mm FFC, FCB Thickness:0.3mm Height Above Board:2mm Contact Material:Phosphor bronze Contact Plating:Go; LCSC Part Name: 间距:0.5mm P数:10P 翻盖式 下接; Supplier Part: C506791; Manufacturer: HRS(广濑); Manufacturer Part: FH12-10S-0.5SH; Supplier Footprint: SMD,P=0.5mm,卧贴; JLCPCB Part Class: Extended Part; Datasheet: https://item.szlcsc.com/datasheet/FH12-10S-0.5SH(55)/519947.html; Supplier: LCSC; Locking Feature: Hinged Lid; Contact Type: Bottom Contact; Number of Contacts: 10P; Pitch: 0.5mm; Mounting Type: Surface Mount, Right Angle; FFC, FCB Thickness: 0.3mm; Height Above Board: 2mm; Contact Material: Phosphor bronze; Contact Plating: Gold; Operating Temperature: -40℃~+85℃; supplier: LCSC; supplierId: C506791
J10-NFC = U.FL-R-SMT-1(80): Supplier Part: C9900020048; Manufacturer Part: U.FL-R-SMT-1; Supplier Footprint: SMA_IPX; JLCPCB Part Class: Extended Part; Supplier: LCSC; supplier: LCSC; supplierId: C9900020048
J12-USB = B-2100S04P-A110: Pin Structure:1x4P Pitch:2.54mm Row Spacing:- Circluar Pins/Square Pins:Pin Header Mounting Type:Through Hole Number of Rows:1 Number of Pins:4P Current Rating:3A Voltage Rating (Max):- Length of Mating Pin:6mm Insulation Height:2.54mm Length of End Conne; LCSC Part Name: 1x4P 间距:2.54mm 方针 直插; Supplier Part: Header-Male-2.54_1x4.1; Manufacturer: Ckmtw(灿科盟); Supplier Footprint: 插件,P=2.54mm; JLCPCB Part Class: Extended Part; Datasheet: https://item.szlcsc.com/datasheet/B-2100S04P-A110/125653.html; Supplier: LCSC; Pin Structure: 1x4P; Pitch: 2.54mm; Circluar Pins/Square Pins: Pin Header; Mounting Type: Through Hole; Number of Rows: 1; Number of Pins: 4P; Current Rating: 3A; Length of Mating Pin: 6mm; Insulation Height: 2.54mm; Length of End Connection Pin: 3mm; Contact Material: Brass; Operating Temperature: -40℃~+105℃; Color: Black
L1-PWR2 = XGL4030-222MEC: Inductance:2.2uH Tolerance:±20% Tolerance:±20% Current - Saturation(Isat):7A DC Resistance(DCR):15mΩ Type:Magnetic Shielded Inductor Ratings:AEC-Q200; LCSC Part Name: 2.2uH ±20% 7A; Supplier Part: C6616463; Manufacturer: Coilcraft(线艺); Supplier Footprint: SMD,4x4mm; JLCPCB Part Class: Extended Part; Datasheet: https://www.coilcraft.com/getmedia/032d9c73-4222-482f-b6bc-7808590e27c9/xgl4030.pdf; Supplier: LCSC; Tolerance: ±20%; Current - Saturation(Isat): 7A; DC Resistance(DCR): 15mΩ; Type: Magnetic Shielded Inductor; Ratings: AEC-Q200; supplier: LCSC; supplierId: C6616463
L2-NFC = LQW15AN5N6C10D: Inductance: Rated Current: Saturation Current (Isat):- DC Resistance (DCR): Ratings:-; LCSC Part Name: 5.6nH; Supplier Part: C91626; Manufacturer: muRata(村田); Supplier Footprint: 0402; JLCPCB Part Class: Extended Part; Datasheet: https://atta.szlcsc.com/upload/public/pdf/source/20161226/1482720179870.pdf; Supplier: LCSC; supplier: LCSC; supplierId: C91626
L4-RTC = XGL4030-472MEC: Inductance:4.7uH Tolerance:±20% Tolerance:±20% Current Rating:6.6A Current - Saturation(Isat):4.4A DC Resistance(DCR):31.5mΩ Type:Magnetic Shielded Inductor Ratings:AEC-Q200; LCSC Part Name: 4.7uH ±20% 4.4A; Supplier Part: C7159276; Manufacturer: Coilcraft(线艺); Supplier Footprint: SMD,4x4mm; JLCPCB Part Class: Extended Part; Datasheet: https://www.coilcraft.com/getmedia/032d9c73-4222-482f-b6bc-7808590e27c9/xgl4030.pdf; Supplier: LCSC; Tolerance: ±20%; Current Rating: 6.6A; Current - Saturation(Isat): 4.4A; DC Resistance(DCR): 31.5mΩ; Type: Magnetic Shielded Inductor; Ratings: AEC-Q200; supplier: LCSC; supplierId: C7159276
Q1-PWR2 = DMG2305UX: Drain to Source Voltage:20V Current - Continuous Drain(Id):4.1A RDS(on):52mΩ@4.5V Pd - Power Dissipation:1.7W Gate Threshold Voltage (Vgs(th)):1V@250uA Gate Charge(Qg):7.8nC Input Capacitance(Ciss):740pF@4V Reverse Transfer Capacitance (Crss@Vds):190pF Op; LCSC Part Name: P沟道 耐压:20V 电流:4.1A; Supplier Part: C2940629; Manufacturer: TECH PUBLIC(台舟); Supplier Footprint: SOT-23; JLCPCB Part Class: Extended Part; Datasheet: https://item.szlcsc.com/datasheet/DMG2305UX/3306169.html; Supplier: LCSC; Drain to Source Voltage: 20V; Current - Continuous Drain(Id): 4.1A; RDS(on): 52mΩ@4.5V; Pd - Power Dissipation: 1.7W; Gate Threshold Voltage (Vgs(th)): 1V@250uA; Gate Charge(Qg): 7.8nC; Input Capacitance(Ciss): 740pF@4V; Reverse Transfer Capacitance (Crss@Vds): 190pF; Operating Temperature: -55℃~+150℃; Type: P-Channel; supplier: LCSC; supplierId: C2940629
Q2-VAL = 2N7002: Type: Drain Source Voltage (Vdss):- Continuous Drain Current (Id):- Power Dissipation (Pd):- Drain Source On Resistance (RDS(on)@Vgs,Id):- Gate Threshold Voltage (Vgs(th)@Id):- Total Gate Charge (Qg@Vgs):- Input Capacitance (Ciss@Vds):- Reverse Transfer C; LCSC Part Name: 停产; Supplier Part: C414014; Supplier Footprint: SOT-23; JLCPCB Part Class: Extended Part; Supplier: LCSC; supplier: LCSC; supplierId: C414014
R1-PWR1 = RNCF0402BTC1K24: Type:Thick Film Resistor Resistance:10kΩ Tolerance:±1% Tolerance:±1% Power(Watts):62.5mW Voltage-Supply(Max):50V Temperature Coefficient:±100ppm/℃ Temperature Coefficient:±100ppm/℃ Operating Temperature:-55℃~+155℃ Operating Temperature:-55℃~+155℃; LCSC Part Name: 厚膜电阻 10kΩ ±1% 62.5mW; Supplier Part: C2491273; Supplier Footprint: 0402; JLCPCB Part Class: Extended Part; Datasheet: https://item.szlcsc.com/datasheet/RC0402FR-0710KL/61542.html; Supplier: LCSC; Type: Thick Film Resistor; Tolerance: ±0.1%; Power(Watts): 62.5mW; Voltage-Supply(Max): 50V; Temperature Coefficient: ±100ppm/℃; Operating Temperature: -55℃~+155℃; supplier: LCSC; supplierId: C2491273
R2-PWR1 R7-PWR2 R9-PWR2 R66-PWR1 R70-RTC = RC0402FR-07100KL: Type:Thick Film Resistor Resistance:100kΩ Tolerance:±1% Tolerance:±1% Power(Watts):62.5mW Voltage-Supply(Max):50V Temperature Coefficient:±100ppm/℃ Temperature Coefficient:±100ppm/℃ Operating Temperature:-55℃~+155℃ Operating Temperature:-55℃~+155℃; LCSC Part Name: 厚膜电阻 100kΩ ±1% 62.5mW; Supplier Part: C60491; Manufacturer: YAGEO(国巨); Supplier Footprint: 0402; JLCPCB Part Class: Extended Part; Datasheet: https://item.szlcsc.com/datasheet/RC0402FR-07100KL/61543.html; Supplier: LCSC; Type: Thick Film Resistor; Tolerance: ±1%; Power(Watts): 62.5mW; Voltage-Supply(Max): 50V; Temperature Coefficient: ±100ppm/℃; Operating Temperature: -55℃~+155℃; supplier: LCSC; supplierId: C60491
R3-PWR1 R10-RTC R11-RTC R12-RTC R14-RTDBG R19-ESP R20-ESP R53-LED R54-LED R61-VAL R62-VAL R67-PWR1 R69-RTDBG R75-PWR2 R76-NFC RLED_ENL_PD-LED RLED_ENR_PD-LED RLED_PD0-LED RLED_PD1-LED RNTC_L-LED RNTC_R-LED = RC0402FR-0710KL: Type:Thick Film Resistor Resistance:10kΩ Tolerance:±1% Tolerance:±1% Power(Watts):62.5mW Voltage-Supply(Max):50V Temperature Coefficient:±100ppm/℃ Temperature Coefficient:±100ppm/℃ Operating Temperature:-55℃~+155℃ Operating Temperature:-55℃~+155℃; LCSC Part Name: 厚膜电阻 10kΩ ±1% 62.5mW; Supplier Part: C60490; Manufacturer: YAGEO(国巨); Supplier Footprint: 0402; JLCPCB Part Class: Extended Part; Datasheet: https://item.szlcsc.com/datasheet/RC0402FR-0710KL/61542.html; Supplier: LCSC; Type: Thick Film Resistor; Tolerance: ±1%; Power(Watts): 62.5mW; Voltage-Supply(Max): 50V; Temperature Coefficient: ±100ppm/℃; Operating Temperature: -55℃~+155℃; supplier: LCSC; supplierId: C60490
R4-PWR1 R28-AUD R29-AUD = RC0402FR-074K7L: Type:Thick Film Resistor Resistance:4.7kΩ Tolerance:±1% Tolerance:±1% Power(Watts):62.5mW Voltage-Supply(Max):50V Temperature Coefficient:±100ppm/℃ Temperature Coefficient:±100ppm/℃ Operating Temperature:-55℃~+155℃ Operating Temperature:-55℃~+155℃; LCSC Part Name: 厚膜电阻 4.7kΩ ±1% 62.5mW; Supplier Part: C105871; Manufacturer: YAGEO(国巨); Supplier Footprint: 0402; JLCPCB Part Class: Extended Part; Datasheet: https://item.szlcsc.com/datasheet/RC0402FR-074K7L/107086.html; Supplier: LCSC; Type: Thick Film Resistor; Tolerance: ±1%; Power(Watts): 62.5mW; Voltage-Supply(Max): 50V; Temperature Coefficient: ±100ppm/℃; Operating Temperature: -55℃~+155℃; supplier: LCSC; supplierId: C105871
R5-PWR2 = RC0402FR-0715K4L: Type:Thick Film Resistor Resistance:10kΩ Tolerance:±1% Tolerance:±1% Power(Watts):62.5mW Voltage-Supply(Max):50V Temperature Coefficient:±100ppm/℃ Temperature Coefficient:±100ppm/℃ Operating Temperature:-55℃~+155℃ Operating Temperature:-55℃~+155℃; LCSC Part Name: 厚膜电阻 10kΩ ±1% 62.5mW; Supplier Part: C185463; Manufacturer: YAGEO; Supplier Footprint: 0402; JLCPCB Part Class: Extended Part; Datasheet: https://item.szlcsc.com/datasheet/RC0402FR-0710KL/61542.html; Supplier: LCSC; Type: Thick Film Resistor; Tolerance: ±1%; Power(Watts): 62.5mW; Voltage-Supply(Max): 50V; Temperature Coefficient: ±100ppm/℃; Operating Temperature: -55℃~+155℃; supplier: LCSC; supplierId: C185463
R6-PWR2 = RC0402FR-074K87L: Type:Thick Film Resistor Resistance:10kΩ Tolerance:±1% Tolerance:±1% Power(Watts):62.5mW Voltage-Supply(Max):50V Temperature Coefficient:±100ppm/℃ Temperature Coefficient:±100ppm/℃ Operating Temperature:-55℃~+155℃ Operating Temperature:-55℃~+155℃; LCSC Part Name: 厚膜电阻 10kΩ ±1% 62.5mW; Supplier Part: C276272; Manufacturer: YAGEO; Supplier Footprint: 0402; JLCPCB Part Class: Extended Part; Datasheet: https://item.szlcsc.com/datasheet/RC0402FR-0710KL/61542.html; Supplier: LCSC; Type: Thick Film Resistor; Tolerance: ±1%; Power(Watts): 62.5mW; Voltage-Supply(Max): 50V; Temperature Coefficient: ±100ppm/℃; Operating Temperature: -55℃~+155℃; supplier: LCSC; supplierId: C276272
R13-RTDBG R34-AUD R35-AUD R36-AUD R44-MOT R46-MOT R48-MOT R55-VAL R58-VAL RUSB_DN-PWR1 RUSB_DP-PWR1 = RC0402FR-070RL: Type:Thick Film Resistor Resistance:0Ω Tolerance:±1% Tolerance:±1% Power(Watts):62.5mW Voltage-Supply(Max):50V Temperature Coefficient:- Temperature Coefficient:- Operating Temperature:-55℃~+155℃ Operating Temperature:-55℃~+155℃; LCSC Part Name: 厚膜电阻 0Ω ±1% 62.5mW; Supplier Part: C106231; Manufacturer: YAGEO(国巨); Supplier Footprint: 0402; JLCPCB Part Class: Extended Part; Datasheet: https://item.szlcsc.com/datasheet/RC0402FR-070RL/107446.html; Supplier: LCSC; Type: Thick Film Resistor; Tolerance: ±1%; Power(Watts): 62.5mW; Voltage-Supply(Max): 50V; Operating Temperature: -55℃~+155℃; supplier: LCSC; supplierId: C106231
R15-RTDBG R16-RTDBG R17-RTDBG R18-RTDBG R23-ESP R24-ESP R25-ESP R26-ESP R27-ESP R31-AUD R32-AUD R33-AUD R37-AUD R38-AUD R39-AUD = RC0402FR-0722RL: Type:Thick Film Resistor Resistance:22Ω Tolerance:±1% Tolerance:±1% Power(Watts):62.5mW Voltage-Supply(Max):50V Temperature Coefficient:±100ppm/℃ Temperature Coefficient:±100ppm/℃ Operating Temperature:-55℃~+155℃ Operating Temperature:-55℃~+155℃; LCSC Part Name: 厚膜电阻 22Ω ±1% 62.5mW; Supplier Part: C114765; Manufacturer: YAGEO(国巨); Supplier Footprint: 0402; JLCPCB Part Class: Extended Part; Datasheet: https://item.szlcsc.com/datasheet/RC0402FR-0722RL/116009.html; Supplier: LCSC; Type: Thick Film Resistor; Tolerance: ±1%; Power(Watts): 62.5mW; Voltage-Supply(Max): 50V; Temperature Coefficient: ±100ppm/℃; Operating Temperature: -55℃~+155℃; supplier: LCSC; supplierId: C114765
R40-AUD R41-AUD = RC0402FR-0722RL: Type:Thick Film Resistor Resistance:22Ω Tolerance:±1% Tolerance:±1% Power(Watts):62.5mW Voltage-Supply(Max):50V Temperature Coefficient:±100ppm/℃ Temperature Coefficient:±100ppm/℃ Operating Temperature:-55℃~+155℃ Operating Temperature:-55℃~+155℃; LCSC Part Name: 厚膜电阻 22Ω ±1% 62.5mW; Supplier Part: C114765; Manufacturer: YAGEO(国巨); Supplier Footprint: 0402; JLCPCB Part Class: Extended Part; Datasheet: https://item.szlcsc.com/datasheet/RC0402FR-0722RL/116009.html; Supplier: LCSC; Type: Thick Film Resistor; Tolerance: ±1%; Power(Watts): 62.5mW; Voltage-Supply(Max): 50V; Temperature Coefficient: ±100ppm/℃; Operating Temperature: -55℃~+155℃; supplier: LCSC
R42-NFC = RC0402FR-072R2L: Type:Thick Film Resistor Resistance:10kΩ Tolerance:±1% Tolerance:±1% Power(Watts):62.5mW Voltage-Supply(Max):50V Temperature Coefficient:±100ppm/℃ Temperature Coefficient:±100ppm/℃ Operating Temperature:-55℃~+155℃ Operating Temperature:-55℃~+155℃; LCSC Part Name: 厚膜电阻 10kΩ ±1% 62.5mW; Supplier Part: C327251; Manufacturer: YAGEO; Supplier Footprint: 0402; JLCPCB Part Class: Extended Part; Datasheet: https://item.szlcsc.com/datasheet/RC0402FR-0710KL/61542.html; Supplier: LCSC; Type: Thick Film Resistor; Tolerance: ±1%; Power(Watts): 62.5mW; Voltage-Supply(Max): 50V; Temperature Coefficient: ±100ppm/℃; Operating Temperature: -55℃~+155℃; supplier: LCSC; supplierId: C327251
R45-MOT R47-MOT = RC0402FR-070RL: Type:Thick Film Resistor Resistance:0Ω Tolerance:±1% Tolerance:±1% Power(Watts):62.5mW Voltage-Supply(Max):50V Temperature Coefficient:- Temperature Coefficient:- Operating Temperature:-55℃~+155℃ Operating Temperature:-55℃~+155℃; LCSC Part Name: 厚膜电阻 0Ω ±1% 62.5mW; Supplier Part: C106231; Manufacturer: YAGEO(国巨); Supplier Footprint: 0402; JLCPCB Part Class: Extended Part; Datasheet: https://item.szlcsc.com/datasheet/RC0402FR-070RL/107446.html; Supplier: LCSC; Type: Thick Film Resistor; Tolerance: ±1%; Power(Watts): 62.5mW; Voltage-Supply(Max): 50V; Operating Temperature: -55℃~+155℃; supplier: LCSC
R49-MOT R56-VAL R57-VAL = RC0402FR-0710KL: Type:Thick Film Resistor Resistance:10kΩ Tolerance:±1% Tolerance:±1% Power(Watts):62.5mW Voltage-Supply(Max):50V Temperature Coefficient:±100ppm/℃ Temperature Coefficient:±100ppm/℃ Operating Temperature:-55℃~+155℃ Operating Temperature:-55℃~+155℃; LCSC Part Name: 厚膜电阻 10kΩ ±1% 62.5mW; Supplier Part: C60490; Manufacturer: YAGEO(国巨); Supplier Footprint: 0402; JLCPCB Part Class: Extended Part; Datasheet: https://item.szlcsc.com/datasheet/RC0402FR-0710KL/61542.html; Supplier: LCSC; Type: Thick Film Resistor; Tolerance: ±1%; Power(Watts): 62.5mW; Voltage-Supply(Max): 50V; Temperature Coefficient: ±100ppm/℃; Operating Temperature: -55℃~+155℃; supplier: LCSC
R51-LED R52-LED = K1_RES0402_TUNE_TBD: Type:Thick Film Resistor Resistance:10kΩ Tolerance:±1% Tolerance:±1% Power(Watts):62.5mW Voltage-Supply(Max):50V Temperature Coefficient:±100ppm/℃ Temperature Coefficient:±100ppm/℃ Operating Temperature:-55℃~+155℃ Operating Temperature:-55℃~+155℃; LCSC Part Name: 厚膜电阻 10kΩ ±1% 62.5mW; Supplier Part: RC0402FR-0733RL.1; Supplier Footprint: 0402; JLCPCB Part Class: Extended Part; Datasheet: https://item.szlcsc.com/datasheet/RC0402FR-0710KL/61542.html; Type: Thick Film Resistor; Power(Watts): 62.5mW; Voltage-Supply(Max): 50V; Temperature Coefficient: ±100ppm/℃; Operating Temperature: -55℃~+155℃; supplier: LCSC; supplierId: RC0402FR-0733RL.1
R59-VAL R60-VAL = RC0402FR-07100RL: Type:Thick Film Resistor Resistance:100Ω Tolerance:±1% Tolerance:±1% Power(Watts):62.5mW Voltage-Supply(Max):50V Temperature Coefficient:±100ppm/℃ Temperature Coefficient:±100ppm/℃ Operating Temperature:-55℃~+155℃ Operating Temperature:-55℃~+155℃; LCSC Part Name: 厚膜电阻 100Ω ±1% 62.5mW; Supplier Part: C106232; Manufacturer: YAGEO(国巨); Supplier Footprint: 0402; JLCPCB Part Class: Extended Part; Datasheet: https://item.szlcsc.com/datasheet/RC0402FR-07100RL/107447.html; Supplier: LCSC; Type: Thick Film Resistor; Tolerance: ±1%; Power(Watts): 62.5mW; Voltage-Supply(Max): 50V; Temperature Coefficient: ±100ppm/℃; Operating Temperature: -55℃~+155℃; supplier: LCSC; supplierId: C106232
R63-PWR1 = RC0402FR-071M05L: Type:Thick Film Resistors Resistance: Tolerance:±1% Tolerance:±1% Power(Watts): Overload Voltage (Max): Temperature Coefficient:±100ppm/℃ Temperature Coefficient:±100ppm/℃ Operating Temperature Range:-55℃~+155℃ Operating Temperature Range:-55℃~+155℃; LCSC Part Name: 厚膜电阻 1.05MΩ ±1% 62.5mW; Supplier Part: C477184; Manufacturer: YAGEO(国巨); Supplier Footprint: 0402; JLCPCB Part Class: Extended Part; Datasheet: https://atta.szlcsc.com/upload/public/pdf/source/20200715/C477184_5FE9413986FB71752D547438B3B15053.pdf; Supplier: LCSC; Type: Thick Film Resistors; Tolerance: ±1%; Temperature Coefficient: ±100ppm/℃; Operating Temperature Range: -55℃~+155℃; supplier: LCSC; supplierId: C477184
R64-PWR1 = RC0402FR-07287KL: Type:Thick Film Resistor Resistance:10kΩ Tolerance:±1% Tolerance:±1% Power(Watts):62.5mW Voltage-Supply(Max):50V Temperature Coefficient:±100ppm/℃ Temperature Coefficient:±100ppm/℃ Operating Temperature:-55℃~+155℃ Operating Temperature:-55℃~+155℃; LCSC Part Name: 厚膜电阻 10kΩ ±1% 62.5mW; Supplier Part: C327358; Manufacturer: YAGEO; Supplier Footprint: 0402; JLCPCB Part Class: Extended Part; Datasheet: https://item.szlcsc.com/datasheet/RC0402FR-0710KL/61542.html; Supplier: LCSC; Type: Thick Film Resistor; Tolerance: ±1%; Power(Watts): 62.5mW; Voltage-Supply(Max): 50V; Temperature Coefficient: ±100ppm/℃; Operating Temperature: -55℃~+155℃; supplier: LCSC; supplierId: C327358
R65-PWR1 = RC0402FR-07274KL: Type:Thick Film Resistors Resistance: Tolerance:±1% Tolerance:±1% Power(Watts): Overload Voltage (Max): Temperature Coefficient:±100ppm/℃ Temperature Coefficient:±100ppm/℃ Operating Temperature Range:-55℃~+155℃ Operating Temperature Range:-55℃~+155℃; LCSC Part Name: 厚膜电阻 274kΩ ±1% 62.5mW; Supplier Part: C185435; Manufacturer: YAGEO(国巨); Supplier Footprint: 0402; JLCPCB Part Class: Extended Part; Datasheet: https://atta.szlcsc.com/upload/public/pdf/source/20180904/C276339_014E484F1DBA106FB92D45EABD5A1AC1.pdf; Supplier: LCSC; Type: Thick Film Resistors; Tolerance: ±1%; Temperature Coefficient: ±100ppm/℃; Operating Temperature Range: -55℃~+155℃; supplier: LCSC; supplierId: C185435
R68-RTDBG = RC0402FR-072M2L: Type:Thick Film Resistor Resistance:2.2MΩ Tolerance:±1% Tolerance:±1% Power(Watts):62.5mW Voltage-Supply(Max):50V Temperature Coefficient:±100ppm/℃ Temperature Coefficient:±100ppm/℃ Operating Temperature:-55℃~+155℃ Operating Temperature:-55℃~+155℃; LCSC Part Name: 厚膜电阻 2.2MΩ ±1% 62.5mW; Supplier Part: C138015; Manufacturer: YAGEO(国巨); Supplier Footprint: 0402; JLCPCB Part Class: Extended Part; Datasheet: https://item.szlcsc.com/datasheet/RC0402FR-072M2L/149331.html; Supplier: LCSC; Type: Thick Film Resistor; Tolerance: ±1%; Power(Watts): 62.5mW; Voltage-Supply(Max): 50V; Temperature Coefficient: ±100ppm/℃; Operating Temperature: -55℃~+155℃; supplier: LCSC; supplierId: C138015
R77-USB = 0402WGF1202TCE: Type:Thick Film Resistor Resistance:12kΩ Tolerance:±1% Tolerance:±1% Power(Watts):62.5mW Voltage-Supply(Max):50V Temperature Coefficient:±100ppm/℃ Temperature Coefficient:±100ppm/℃ Operating Temperature:-55℃~+155℃ Operating Temperature:-55℃~+155℃; LCSC Part Name: 厚膜电阻 12kΩ ±1%; Supplier Part: 0402WGF1202TCE.1; Manufacturer: UNI-ROYAL(厚声); Supplier Footprint: 0402; JLCPCB Part Class: Basic Part; Datasheet: https://item.szlcsc.com/datasheet/0402WGF1202TCE/26495.html; Supplier: LCSC; Type: Thick Film Resistor; Tolerance: ±1%; Power(Watts): 62.5mW; Voltage-Supply(Max): 50V; Temperature Coefficient: ±100ppm/℃; Operating Temperature: -55℃~+155℃
R78-USB R79-USB = 0402WGF1003TCE: Type:Thick Film Resistor Resistance:100kΩ Tolerance:±1% Tolerance:±1% Power(Watts):62.5mW Voltage-Supply(Max):50V Temperature Coefficient:±100ppm/℃ Temperature Coefficient:±100ppm/℃ Operating Temperature:-55℃~+155℃ Operating Temperature:-55℃~+155℃; LCSC Part Name: 厚膜电阻 100kΩ ±1%; Supplier Part: 0402WGF1003TCE.1; Manufacturer: UNI-ROYAL(厚声); Supplier Footprint: 0402; JLCPCB Part Class: Basic Part; Datasheet: https://item.szlcsc.com/datasheet/0402WGF1003TCE/26484.html; Supplier: LCSC; Type: Thick Film Resistor; Tolerance: ±1%; Power(Watts): 62.5mW; Voltage-Supply(Max): 50V; Temperature Coefficient: ±100ppm/℃; Operating Temperature: -55℃~+155℃
R80-USB = 0402WGF4701TCE: Type:Thick Film Resistor Resistance:4.7kΩ Tolerance:±1% Tolerance:±1% Power(Watts):62.5mW Voltage-Supply(Max):50V Temperature Coefficient:±100ppm/℃ Temperature Coefficient:±100ppm/℃ Operating Temperature:-55℃~+155℃ Operating Temperature:-55℃~+155℃; LCSC Part Name: 厚膜电阻 4.7kΩ ±1%; Supplier Part: 0402WGF4701TCE.1; Manufacturer: UNI-ROYAL(厚声); Supplier Footprint: 0402; JLCPCB Part Class: Basic Part; Datasheet: https://item.szlcsc.com/datasheet/0402WGF4701TCE/26643.html; Supplier: LCSC; Type: Thick Film Resistor; Tolerance: ±1%; Power(Watts): 62.5mW; Voltage-Supply(Max): 50V; Temperature Coefficient: ±100ppm/℃; Operating Temperature: -55℃~+155℃
